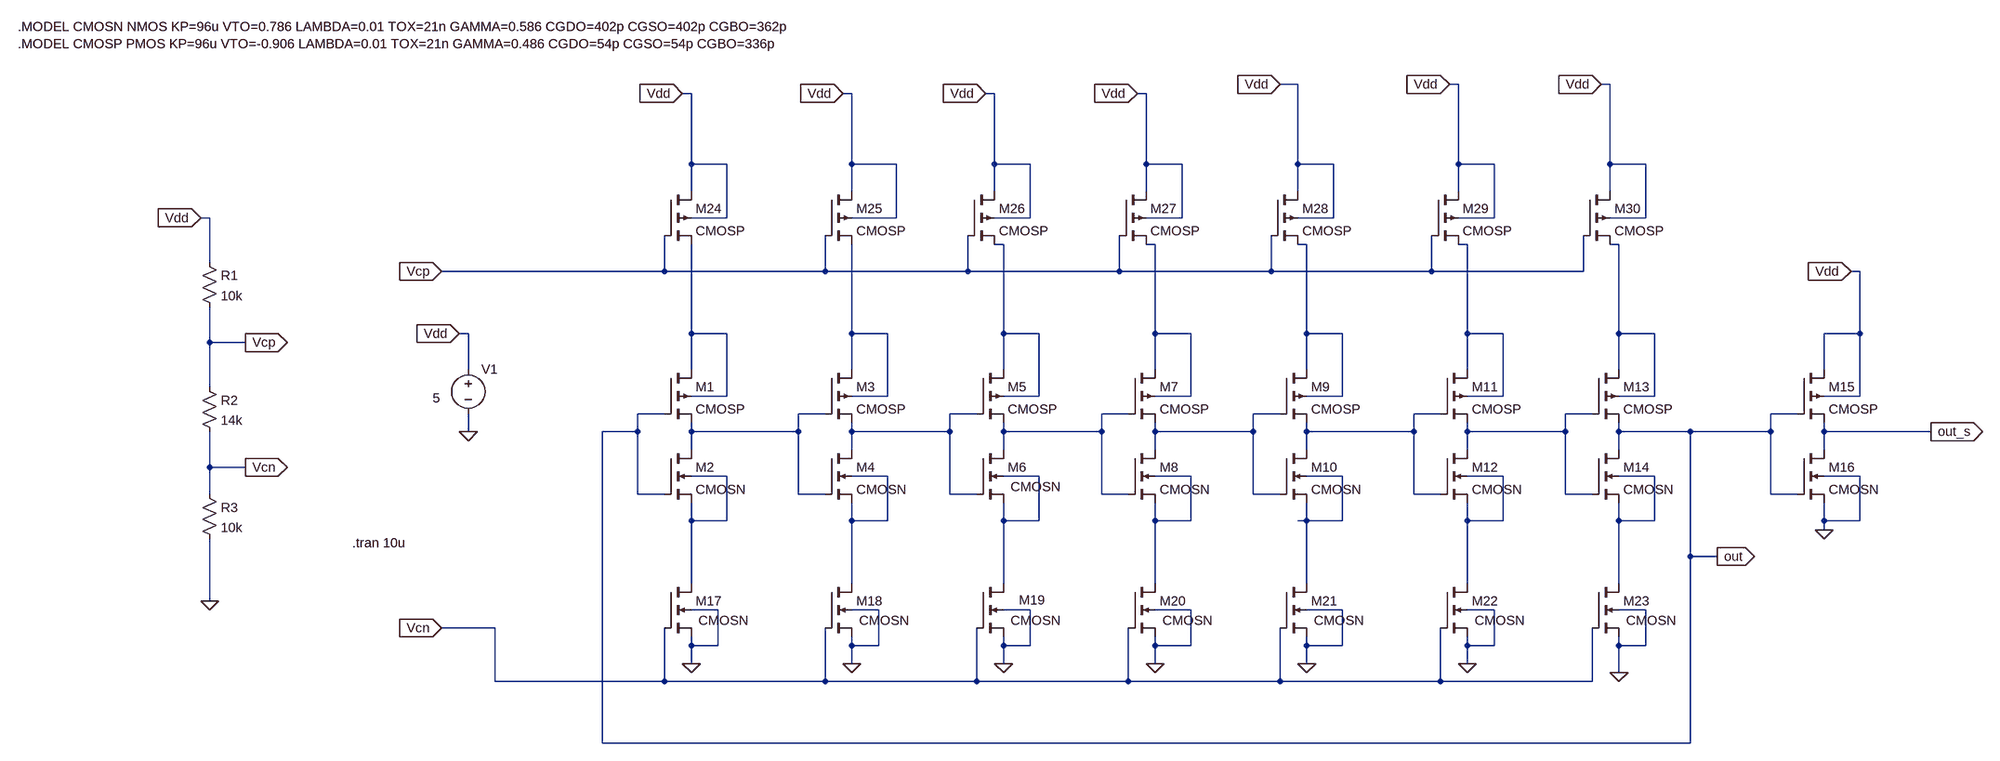
[diagram p0: schematic VCO-1.asc]
VCO-1.asc, the LTspice schematic file:
Version 4
SHEET 1 2556 788
WIRE 1296 -480 1264 -480
WIRE 1584 -480 1568 -480
WIRE 1856 -480 1840 -480
WIRE 208 -464 192 -464
WIRE 496 -464 480 -464
WIRE 752 -464 736 -464
WIRE 1024 -464 1008 -464
WIRE 208 -320 208 -464
WIRE 272 -320 208 -320
WIRE 496 -320 496 -464
WIRE 576 -320 496 -320
WIRE 752 -320 752 -464
WIRE 816 -320 752 -320
WIRE 1024 -320 1024 -464
WIRE 1088 -320 1024 -320
WIRE 1296 -320 1296 -480
WIRE 1360 -320 1296 -320
WIRE 1584 -320 1584 -480
WIRE 1648 -320 1584 -320
WIRE 1856 -320 1856 -480
WIRE 1920 -320 1856 -320
WIRE 208 -272 208 -320
WIRE 496 -272 496 -320
WIRE 752 -272 752 -320
WIRE 1024 -272 1024 -320
WIRE 1296 -272 1296 -320
WIRE 1584 -272 1584 -320
WIRE 1856 -272 1856 -320
WIRE -656 -224 -672 -224
WIRE 272 -224 272 -320
WIRE 272 -224 208 -224
WIRE 576 -224 576 -320
WIRE 576 -224 496 -224
WIRE 816 -224 816 -320
WIRE 816 -224 752 -224
WIRE 1088 -224 1088 -320
WIRE 1088 -224 1024 -224
WIRE 1360 -224 1360 -320
WIRE 1360 -224 1296 -224
WIRE 1648 -224 1648 -320
WIRE 1648 -224 1584 -224
WIRE 1920 -224 1920 -320
WIRE 1920 -224 1856 -224
WIRE 768 -176 752 -176
WIRE 1040 -176 1024 -176
WIRE 1312 -176 1296 -176
WIRE 1600 -176 1584 -176
WIRE 1872 -176 1856 -176
WIRE -656 -144 -656 -224
WIRE 160 -128 160 -192
WIRE 160 -128 -240 -128
WIRE 448 -128 448 -192
WIRE 448 -128 160 -128
WIRE 704 -128 704 -192
WIRE 704 -128 448 -128
WIRE 976 -128 976 -192
WIRE 976 -128 704 -128
WIRE 1248 -128 1248 -192
WIRE 1248 -128 976 -128
WIRE 1536 -128 1536 -192
WIRE 1536 -128 1248 -128
WIRE 1808 -128 1808 -192
WIRE 1808 -128 1536 -128
WIRE 2304 -128 2288 -128
WIRE -192 -16 -208 -16
WIRE 208 -16 208 -176
WIRE 272 -16 208 -16
WIRE 496 -16 496 -176
WIRE 560 -16 496 -16
WIRE 768 -16 768 -176
WIRE 832 -16 768 -16
WIRE 1040 -16 1040 -176
WIRE 1104 -16 1040 -16
WIRE 1312 -16 1312 -176
WIRE 1376 -16 1312 -16
WIRE 1600 -16 1600 -176
WIRE 1664 -16 1600 -16
WIRE 1872 -16 1872 -176
WIRE 1936 -16 1872 -16
WIRE 2304 -16 2304 -128
WIRE 2304 -16 2240 -16
WIRE -656 0 -656 -64
WIRE -592 0 -656 0
WIRE -192 48 -192 -16
WIRE 208 48 208 -16
WIRE 496 48 496 -16
WIRE 768 48 768 -16
WIRE 1040 48 1040 -16
WIRE 1312 48 1312 -16
WIRE 1600 48 1600 -16
WIRE 1872 48 1872 -16
WIRE 2240 48 2240 -16
WIRE -656 80 -656 0
WIRE 272 96 272 -16
WIRE 272 96 208 96
WIRE 560 96 560 -16
WIRE 560 96 496 96
WIRE 832 96 832 -16
WIRE 832 96 768 96
WIRE 1104 96 1104 -16
WIRE 1104 96 1040 96
WIRE 1376 96 1376 -16
WIRE 1376 96 1312 96
WIRE 1664 96 1664 -16
WIRE 1664 96 1600 96
WIRE 1936 96 1936 -16
WIRE 1936 96 1872 96
WIRE 2304 96 2304 -16
WIRE 2304 96 2240 96
WIRE 160 128 112 128
WIRE 448 128 400 128
WIRE 720 128 672 128
WIRE 992 128 944 128
WIRE 1264 128 1216 128
WIRE 1552 128 1504 128
WIRE 1824 128 1776 128
WIRE 2192 128 2144 128
WIRE -192 160 -192 128
WIRE 112 160 112 128
WIRE 112 160 48 160
WIRE 208 160 208 144
WIRE 400 160 400 128
WIRE 400 160 208 160
WIRE 496 160 496 144
WIRE 672 160 672 128
WIRE 672 160 496 160
WIRE 768 160 768 144
WIRE 944 160 944 128
WIRE 944 160 768 160
WIRE 1040 160 1040 144
WIRE 1216 160 1216 128
WIRE 1216 160 1040 160
WIRE 1312 160 1312 144
WIRE 1504 160 1504 128
WIRE 1504 160 1312 160
WIRE 1600 160 1600 144
WIRE 1776 160 1776 128
WIRE 1776 160 1600 160
WIRE 1872 160 1872 144
WIRE 2000 160 1872 160
WIRE 2144 160 2144 128
WIRE 2144 160 2000 160
WIRE 2240 160 2240 144
WIRE 2432 160 2240 160
WIRE 208 192 208 160
WIRE 496 192 496 160
WIRE 768 192 768 160
WIRE 1040 192 1040 160
WIRE 1312 192 1312 160
WIRE 1600 192 1600 160
WIRE 1872 192 1872 160
WIRE 2240 192 2240 160
WIRE -656 224 -656 160
WIRE -592 224 -656 224
WIRE 272 240 208 240
WIRE 560 240 496 240
WIRE 832 240 768 240
WIRE 1104 240 1040 240
WIRE 1376 240 1312 240
WIRE 1664 240 1600 240
WIRE 1936 240 1872 240
WIRE 2304 240 2240 240
WIRE -656 272 -656 224
WIRE 112 272 112 160
WIRE 160 272 112 272
WIRE 400 272 400 160
WIRE 448 272 400 272
WIRE 672 272 672 160
WIRE 720 272 672 272
WIRE 944 272 944 160
WIRE 992 272 944 272
WIRE 1216 272 1216 160
WIRE 1264 272 1216 272
WIRE 1504 272 1504 160
WIRE 1552 272 1504 272
WIRE 1776 272 1776 160
WIRE 1824 272 1776 272
WIRE 2144 272 2144 160
WIRE 2192 272 2144 272
WIRE 208 320 208 288
WIRE 272 320 272 240
WIRE 272 320 208 320
WIRE 496 320 496 288
WIRE 560 320 560 240
WIRE 560 320 496 320
WIRE 768 320 768 288
WIRE 832 320 832 240
WIRE 832 320 768 320
WIRE 1040 320 1040 288
WIRE 1104 320 1104 240
WIRE 1104 320 1040 320
WIRE 1312 320 1312 288
WIRE 1312 320 1296 320
WIRE 1376 320 1376 240
WIRE 1376 320 1312 320
WIRE 1600 320 1600 288
WIRE 1664 320 1664 240
WIRE 1664 320 1600 320
WIRE 1872 320 1872 288
WIRE 1936 320 1936 240
WIRE 1936 320 1872 320
WIRE 2240 320 2240 288
WIRE 2304 320 2304 240
WIRE 2304 320 2240 320
WIRE 2240 336 2240 320
WIRE 2000 384 2000 160
WIRE 2048 384 2000 384
WIRE 208 432 208 320
WIRE 496 432 496 320
WIRE 768 432 768 320
WIRE 1040 432 1040 320
WIRE 1312 432 1312 320
WIRE 1600 432 1600 320
WIRE 1872 432 1872 320
WIRE -656 464 -656 352
WIRE 256 480 208 480
WIRE 544 480 496 480
WIRE 816 480 768 480
WIRE 1104 480 1040 480
WIRE 1376 480 1312 480
WIRE 1648 480 1600 480
WIRE 1920 480 1872 480
WIRE -144 512 -240 512
WIRE 208 544 208 528
WIRE 256 544 256 480
WIRE 256 544 208 544
WIRE 496 544 496 528
WIRE 544 544 544 480
WIRE 544 544 496 544
WIRE 768 544 768 528
WIRE 816 544 816 480
WIRE 816 544 768 544
WIRE 1040 544 1040 528
WIRE 1104 544 1104 480
WIRE 1104 544 1040 544
WIRE 1312 544 1312 528
WIRE 1376 544 1376 480
WIRE 1376 544 1312 544
WIRE 1600 544 1600 528
WIRE 1648 544 1648 480
WIRE 1648 544 1600 544
WIRE 1872 544 1872 528
WIRE 1920 544 1920 480
WIRE 1920 544 1872 544
WIRE 208 576 208 544
WIRE 496 576 496 544
WIRE 768 576 768 544
WIRE 1040 576 1040 544
WIRE 1312 576 1312 544
WIRE 1600 576 1600 544
WIRE 1872 592 1872 544
WIRE -144 608 -144 512
WIRE 160 608 160 512
WIRE 160 608 -144 608
WIRE 448 608 448 512
WIRE 448 608 160 608
WIRE 720 608 720 512
WIRE 720 608 448 608
WIRE 992 608 992 512
WIRE 992 608 720 608
WIRE 1264 608 1264 512
WIRE 1264 608 992 608
WIRE 1552 608 1552 512
WIRE 1552 608 1264 608
WIRE 1824 608 1824 512
WIRE 1824 608 1552 608
WIRE 48 784 48 160
WIRE 2000 784 2000 384
WIRE 2000 784 48 784
FLAG 192 -464 Vdd
IOPIN 192 -464 In
FLAG 2048 384 out
IOPIN 2048 384 Out
FLAG -208 -16 Vdd
IOPIN -208 -16 In
FLAG -192 160 0
FLAG 2240 336 0
FLAG 2288 -128 Vdd
IOPIN 2288 -128 In
FLAG 2432 160 out_s
IOPIN 2432 160 Out
FLAG 208 576 0
FLAG 496 576 0
FLAG 768 576 0
FLAG 1040 576 0
FLAG 1312 576 0
FLAG 1600 576 0
FLAG 1872 592 0
FLAG 480 -464 Vdd
IOPIN 480 -464 In
FLAG 736 -464 Vdd
IOPIN 736 -464 In
FLAG 1008 -464 Vdd
IOPIN 1008 -464 In
FLAG 1264 -480 Vdd
IOPIN 1264 -480 In
FLAG 1568 -480 Vdd
IOPIN 1568 -480 In
FLAG 1840 -480 Vdd
IOPIN 1840 -480 In
FLAG -240 512 Vcn
IOPIN -240 512 In
FLAG -240 -128 Vcp
IOPIN -240 -128 In
FLAG -672 -224 Vdd
IOPIN -672 -224 In
FLAG -656 464 0
FLAG -592 0 Vcp
IOPIN -592 0 Out
FLAG -592 224 Vcn
IOPIN -592 224 Out
SYMBOL pmos4 160 48 R0
SYMATTR InstName M1
SYMATTR Value2 l=10u w=200u
SYMATTR Value CMOSP
SYMBOL nmos4 160 192 R0
SYMATTR InstName M2
SYMATTR Value2 l=10u w=100u
SYMATTR Value CMOSN
SYMBOL pmos4 448 48 R0
SYMATTR InstName M3
SYMATTR Value2 l=10u w=200u
SYMATTR Value CMOSP
SYMBOL nmos4 448 192 R0
SYMATTR InstName M4
SYMATTR Value2 l=10u w=100u
SYMATTR Value CMOSN
SYMBOL pmos4 720 48 R0
SYMATTR InstName M5
SYMATTR Value2 l=10u w=200u
SYMATTR Value CMOSP
SYMBOL nmos4 720 192 R0
WINDOW 3 61 67 Left 2
SYMATTR Value CMOSN
SYMATTR InstName M6
SYMATTR Value2 l=10u w=100u
SYMBOL voltage -192 32 R0
WINDOW 3 -64 68 Left 2
WINDOW 123 0 0 Left 0
WINDOW 39 0 0 Left 0
SYMATTR Value 5
SYMATTR InstName V1
SYMBOL pmos4 992 48 R0
SYMATTR InstName M7
SYMATTR Value2 l=10u w=200u
SYMATTR Value CMOSP
SYMBOL nmos4 992 192 R0
SYMATTR InstName M8
SYMATTR Value2 l=10u w=100u
SYMATTR Value CMOSN
SYMBOL pmos4 1264 48 R0
SYMATTR InstName M9
SYMATTR Value2 l=10u w=200u
SYMATTR Value CMOSP
SYMBOL nmos4 1264 192 R0
SYMATTR InstName M10
SYMATTR Value2 l=10u w=100u
SYMATTR Value CMOSN
SYMBOL pmos4 1552 48 R0
SYMATTR InstName M11
SYMATTR Value2 l=10u w=200u
SYMATTR Value CMOSP
SYMBOL nmos4 1552 192 R0
SYMATTR InstName M12
SYMATTR Value2 l=10u w=100u
SYMATTR Value CMOSN
SYMBOL pmos4 1824 48 R0
SYMATTR InstName M13
SYMATTR Value2 l=10u w=200u
SYMATTR Value CMOSP
SYMBOL nmos4 1824 192 R0
SYMATTR InstName M14
SYMATTR Value2 l=10u w=100u
SYMATTR Value CMOSN
SYMBOL pmos4 2192 48 R0
SYMATTR InstName M15
SYMATTR Value2 l=10u w=200u
SYMATTR Value CMOSP
SYMBOL nmos4 2192 192 R0
SYMATTR InstName M16
SYMATTR Value2 l=10u w=100u
SYMATTR Value CMOSN
SYMBOL nmos4 160 432 R0
WINDOW 3 61 67 Left 2
SYMATTR Value CMOSN
SYMATTR InstName M17
SYMATTR Value2 l=10u w=100u
SYMBOL nmos4 448 432 R0
WINDOW 3 61 67 Left 2
SYMATTR Value CMOSN
SYMATTR InstName M18
SYMATTR Value2 l=10u w=100u
SYMBOL nmos4 720 432 R0
WINDOW 0 76 30 Left 2
WINDOW 3 61 67 Left 2
SYMATTR InstName M19
SYMATTR Value CMOSN
SYMATTR Value2 l=10u w=100u
SYMBOL nmos4 992 432 R0
WINDOW 3 61 67 Left 2
SYMATTR Value CMOSN
SYMATTR InstName M20
SYMATTR Value2 l=10u w=100u
SYMBOL nmos4 1264 432 R0
WINDOW 3 61 67 Left 2
SYMATTR Value CMOSN
SYMATTR InstName M21
SYMATTR Value2 l=10u w=100u
SYMBOL nmos4 1552 432 R0
WINDOW 3 61 67 Left 2
SYMATTR Value CMOSN
SYMATTR InstName M22
SYMATTR Value2 l=10u w=100u
SYMBOL nmos4 1824 432 R0
WINDOW 3 61 67 Left 2
SYMATTR Value CMOSN
SYMATTR InstName M23
SYMATTR Value2 l=10u w=100u
SYMBOL pmos4 160 -272 R0
SYMATTR InstName M24
SYMATTR Value2 l=10u w=200u
SYMATTR Value CMOSP
SYMBOL pmos4 448 -272 R0
SYMATTR InstName M25
SYMATTR Value2 l=10u w=200u
SYMATTR Value CMOSP
SYMBOL pmos4 704 -272 R0
SYMATTR InstName M26
SYMATTR Value2 l=10u w=200u
SYMATTR Value CMOSP
SYMBOL pmos4 976 -272 R0
SYMATTR InstName M27
SYMATTR Value2 l=10u w=200u
SYMATTR Value CMOSP
SYMBOL pmos4 1248 -272 R0
SYMATTR InstName M28
SYMATTR Value2 l=10u w=200u
SYMATTR Value CMOSP
SYMBOL pmos4 1536 -272 R0
SYMATTR InstName M29
SYMATTR Value2 l=10u w=200u
SYMATTR Value CMOSP
SYMBOL pmos4 1808 -272 R0
SYMATTR InstName M30
SYMATTR Value2 l=10u w=200u
SYMATTR Value CMOSP
SYMBOL res -672 -160 R0
SYMATTR InstName R1
SYMATTR Value 10k
SYMBOL res -672 64 R0
SYMATTR InstName R2
SYMATTR Value 14k
SYMBOL res -672 256 R0
SYMATTR InstName R3
SYMATTR Value 10k
TEXT -1000 -584 Left 2 !.MODEL CMOSN NMOS KP=96u VTO=0.786 LAMBDA=0.01 TOX=21n GAMMA=0.586 CGDO=402p CGSO=402p CGBO=362p\n.MODEL CMOSP PMOS KP=96u VTO=-0.906 LAMBDA=0.01 TOX=21n GAMMA=0.486 CGDO=54p CGSO=54p CGBO=336p
TEXT -400 360 Left 2 !.tran 10u

The netlist it stands for:
* VCO-1.asc
M1 N006 out N008 N006 CMOSP l=10u w=200u
M2 N008 out N014 N014 CMOSN l=10u w=100u
M3 N007 N008 N009 N007 CMOSP l=10u w=200u
M4 N009 N008 N015 N015 CMOSN l=10u w=100u
M5 N001 N009 N010 N001 CMOSP l=10u w=200u
M6 N010 N009 N016 N016 CMOSN l=10u w=100u
V1 Vdd 0 5
M7 N002 N010 N011 N002 CMOSP l=10u w=200u
M8 N011 N010 N017 N017 CMOSN l=10u w=100u
M9 N003 N011 N012 N003 CMOSP l=10u w=200u
M10 N012 N011 N018 N018 CMOSN l=10u w=100u
M11 N004 N012 N013 N004 CMOSP l=10u w=200u
M12 N013 N012 N019 N019 CMOSN l=10u w=100u
M13 N005 N013 out N005 CMOSP l=10u w=200u
M14 out N013 N020 N020 CMOSN l=10u w=100u
M15 Vdd out out_s Vdd CMOSP l=10u w=200u
M16 out_s out 0 0 CMOSN l=10u w=100u
M17 N014 Vcn 0 0 CMOSN l=10u w=100u
M18 N015 Vcn 0 0 CMOSN l=10u w=100u
M19 N016 Vcn 0 0 CMOSN l=10u w=100u
M20 N017 Vcn 0 0 CMOSN l=10u w=100u
M21 N018 Vcn 0 0 CMOSN l=10u w=100u
M22 N019 Vcn 0 0 CMOSN l=10u w=100u
M23 N020 Vcn 0 0 CMOSN l=10u w=100u
M24 Vdd Vcp N006 Vdd CMOSP l=10u w=200u
M25 Vdd Vcp N007 Vdd CMOSP l=10u w=200u
M26 Vdd Vcp N001 Vdd CMOSP l=10u w=200u
M27 Vdd Vcp N002 Vdd CMOSP l=10u w=200u
M28 Vdd Vcp N003 Vdd CMOSP l=10u w=200u
M29 Vdd Vcp N004 Vdd CMOSP l=10u w=200u
M30 Vdd Vcp N005 Vdd CMOSP l=10u w=200u
R1 Vdd Vcp 10k
R2 Vcp Vcn 14k
R3 Vcn 0 10k
.model NMOS NMOS
.model PMOS PMOS
.lib standard.mos
.MODEL CMOSN NMOS KP=96u VTO=0.786 LAMBDA=0.01 TOX=21n GAMMA=0.586 CGDO=402p CGSO=402p CGBO=362p
.MODEL CMOSP PMOS KP=96u VTO=-0.906 LAMBDA=0.01 TOX=21n GAMMA=0.486 CGDO=54p CGSO=54p CGBO=336p
.tran 10u
.backanno
.end